# Altium project TCA785_HAFTWAVE.PrjPcb
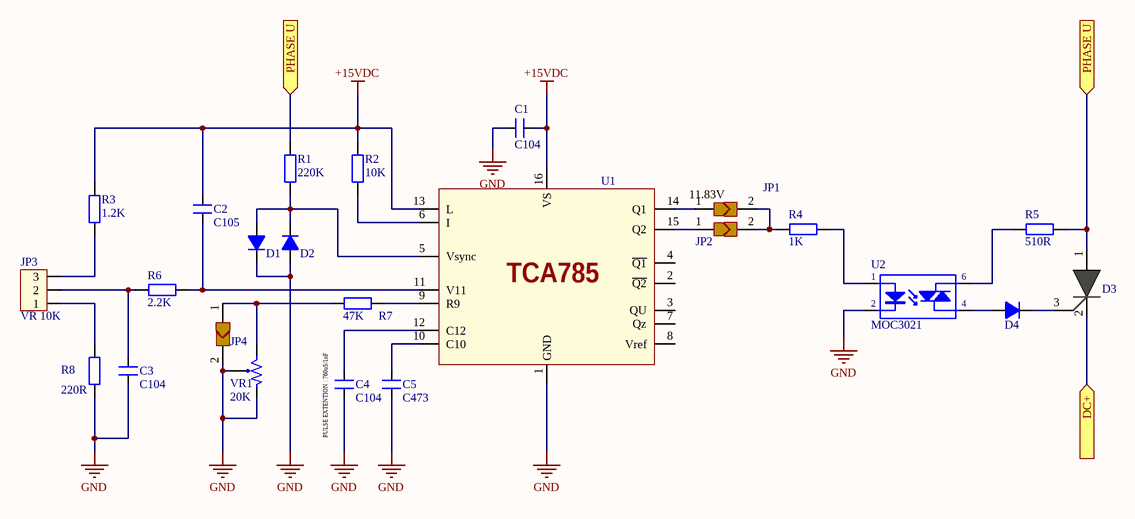
[diagram p0: TCA785-U.SchDoc]
4 sheets, 91 parts. Net scope: flat (ports and power ports of the same name join across sheets).
Board file: PCB1.PcbDoc
Sheets:
  TCA785-U.SchDoc
  TCA785-V.SchDoc
  TCA785-W.SchDoc
  POWER-SUPPLY.SchDoc

## Sheet TCA785-U.SchDoc
size A; SheetNumber: 1; SheetTotal: 4

### Parts
C1  C104  [CN2-O]
C2  C105  [CN2-O]
C3  C104  [CN2-O]
C4  C104  [CN2-O]
C5  C473  [CN2-O]
D1  Diode  1N4007  [DO41-1A]  (value not drawn)
D2  Diode  1N4007  [DO41-1A]  (value not drawn)
D3  SCR  [TO-220]  (value not drawn)
D4  Diode  1N4007  [DO41-1A]  (value not drawn)
JP1  PAD_Sellect  [PAD Select]  (value not drawn)
JP2  PAD_Sellect  [PAD Select]  (value not drawn)
JP3  VR 10K  [CON3]
JP4  PAD_Sellect  [PAD Select]  (value not drawn)
R1  220K  [R1/4W]
R2  10K  [R1/4W]
R3  1.2K  [R1/4W]
R4  1K  [R1/4W]
R5  510R  [R1/4W]
R6  2.2K  [R1/4W]
R7  47K  [R1/4W]
R8  220R  [R1/4W]
U1  TCA785Q  [DIP-16]  (value not drawn)
U2  MOC3021  [DIP6/W0.3 - MOC3021]
VR1  20K  [VR]

### Ports
DC+ (in), PHASE U (in)

### Nets
+15VDC: C1.2 C2.2 R2.1 R3.2 U1.13(L) U1.16(VS)
GND: C1.1 C3.1 C4.1 C5.1 D1.2 D2.1 JP4.2 R8.1 U1.1(GND) U2.2(K) VR1.1 VR1.2
NetC2_1: C2.1 R6.1 U1.11(V11)
NetC3_2: C3.2 JP3.2 R6.2
NetC4_2: C4.2 U1.12(C12)
NetC5_2: C5.2 U1.10(C10)
NetC18_2: D3.2(K) ; port DC+
NetD1_1: D1.1 D2.2 R1.2 U1.5(Vsync)
NetD3_1: D3.1(A) R1.1 R5.1 ; port PHASE U
NetD3_3: D3.3(G) D4.2
NetD4_1: D4.1 U2.4(E)
NetJP1_1: JP1.1 U1.14(Q1)
NetJP1_2: JP1.2 JP2.2 R4.2
NetJP2_1: JP2.1 U1.15(Q2)
NetJP3_1: JP3.1 R8.2
NetJP3_3: JP3.3 R3.1
NetJP4_1: JP4.1 R7.1 VR1.3
NetR2_2: R2.2 U1.6(I)
NetR4_1: R4.1 U2.1(A)
NetR5_2: R5.2 U2.6(C)
NetR7_2: R7.2 U1.9(R9)

Not connected (* = marked no-connect by the designer): U1 2(~{Q2}) 3(QU) 4(~{Q1}) 7(Qz) 8(Vref)

### Notes on the sheet
- (near JP1) 11.83V
- (near C4) PULSE EXTENTION : 760uS/1nF
- (in symbol TCA785Q) TCA785

### Library data of the parts
C1-C5 = CAP-gom: Value: 33pF
D1 D2 D4 = Diode  1N4007: Diode 1A; Value: 1N4007
D3 = BT151
JP3 = Con3: Connector 3; Value: Connector 3
R1-R8 = R1/4W: Resistor 1/4W; Value: R1/4W - 1K
U2 = MOC3021: Single Opto; Value: MOC3021
VR1 = VR: Var Resistor RM065; RM065-104: 10K; RM065-503: 5K; RM065-103: 1K

## Sheet TCA785-V.SchDoc
size A; SheetNumber: 2; SheetTotal: 4
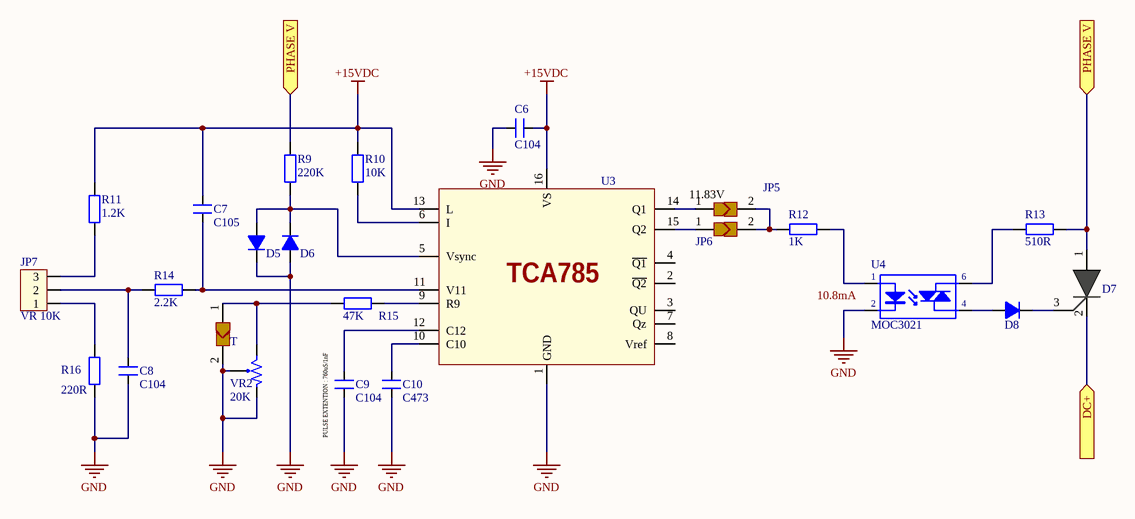
[diagram p1: TCA785-V.SchDoc]

### Parts
C6  C104  [CN2-O]
C7  C105  [CN2-O]
C8  C104  [CN2-O]
C9  C104  [CN2-O]
C10  C473  [CN2-O]
D5  Diode  1N4007  [DO41-1A]  (value not drawn)
D6  Diode  1N4007  [DO41-1A]  (value not drawn)
D7  SCR  [TO-220]  (value not drawn)
D8  Diode  1N4007  [DO41-1A]  (value not drawn)
JP5  PAD_Sellect  [PAD Select]  (value not drawn)
JP6  PAD_Sellect  [PAD Select]  (value not drawn)
JP7  VR 10K  [CON3]
R9  220K  [R1/4W]
R10  10K  [R1/4W]
R11  1.2K  [R1/4W]
R12  1K  [R1/4W]
R13  510R  [R1/4W]
R14  2.2K  [R1/4W]
R15  47K  [R1/4W]
R16  220R  [R1/4W]
T  PAD_Sellect  [PAD Select]  (value not drawn)
U3  TCA785Q  [DIP-16]  (value not drawn)
U4  MOC3021  [DIP6/W0.3 - MOC3021]
VR2  20K  [VR]

### Ports
DC+ (in), PHASE V (in)

### Nets
+15VDC: C6.2 C7.2 R10.1 R11.2 U3.13(L) U3.16(VS)
GND: C6.1 C8.1 C9.1 C10.1 D5.2 D6.1 R16.1 T.2 U3.1(GND) U4.2(K) VR2.1 VR2.2
NetC7_1: C7.1 R14.1 U3.11(V11)
NetC8_2: C8.2 JP7.2 R14.2
NetC9_2: C9.2 U3.12(C12)
NetC10_2: C10.2 U3.10(C10)
NetC18_2: D7.2(K) ; port DC+
NetD5_1: D5.1 D6.2 R9.2 U3.5(Vsync)
NetD7_1: D7.1(A) R9.1 R13.1 ; port PHASE V
NetD7_3: D7.3(G) D8.2
NetD8_1: D8.1 U4.4(E)
NetJP5_1: JP5.1 U3.14(Q1)
NetJP5_2: JP5.2 JP6.2 R12.2
NetJP6_1: JP6.1 U3.15(Q2)
NetJP7_1: JP7.1 R16.2
NetJP7_3: JP7.3 R11.1
NetR10_2: R10.2 U3.6(I)
NetR12_1: R12.1 U4.1(A)
NetR13_2: R13.2 U4.6(C)
NetR15_1: R15.1 T.1 VR2.3
NetR15_2: R15.2 U3.9(R9)

Not connected (* = marked no-connect by the designer): U3 2(~{Q2}) 3(QU) 4(~{Q1}) 7(Qz) 8(Vref)

### Notes on the sheet
- (near JP5) 11.83V
- (near C9) PULSE EXTENTION : 760uS/1nF
- Labels drawn without touching a wire or pin: 10.8mA
- (in symbol TCA785Q) TCA785

### Library data of the parts
C6-C10 = CAP-gom: Value: 33pF
D5 D6 D8 = Diode  1N4007: Diode 1A; Value: 1N4007
D7 = BT151
JP7 = Con3: Connector 3; Value: Connector 3
R9-R16 = R1/4W: Resistor 1/4W; Value: R1/4W - 1K
U4 = MOC3021: Single Opto; Value: MOC3021
VR2 = VR: as VR1 on sheet TCA785-U

## Sheet TCA785-W.SchDoc
size A; SheetNumber: 3; SheetTotal: 4
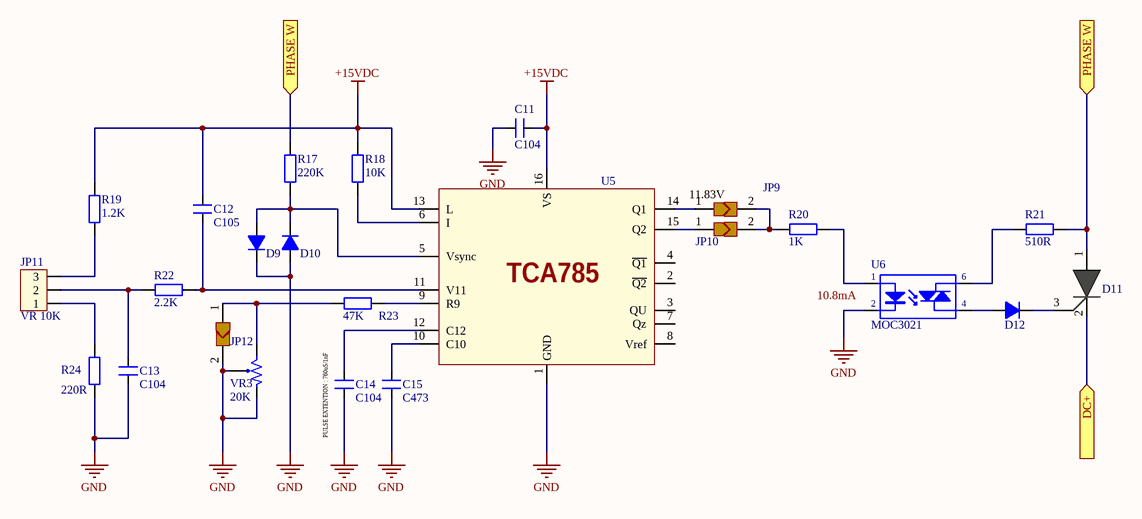
[diagram p2: TCA785-W.SchDoc]

### Parts
C11  C104  [CN2-O]
C12  C105  [CN2-O]
C13  C104  [CN2-O]
C14  C104  [CN2-O]
C15  C473  [CN2-O]
D9  Diode  1N4007  [DO41-1A]  (value not drawn)
D10  Diode  1N4007  [DO41-1A]  (value not drawn)
D11  SCR  [TO-220]  (value not drawn)
D12  Diode  1N4007  [DO41-1A]  (value not drawn)
JP9  PAD_Sellect  [PAD Select]  (value not drawn)
JP10  PAD_Sellect  [PAD Select]  (value not drawn)
JP11  VR 10K  [CON3]
JP12  PAD_Sellect  [PAD Select]  (value not drawn)
R17  220K  [R1/4W]
R18  10K  [R1/4W]
R19  1.2K  [R1/4W]
R20  1K  [R1/4W]
R21  510R  [R1/4W]
R22  2.2K  [R1/4W]
R23  47K  [R1/4W]
R24  220R  [R1/4W]
U5  TCA785Q  [DIP-16]  (value not drawn)
U6  MOC3021  [DIP6/W0.3 - MOC3021]
VR3  20K  [VR]

### Ports
DC+ (in), PHASE W (in)

### Nets
+15VDC: C11.2 C12.2 R18.1 R19.2 U5.13(L) U5.16(VS)
GND: C11.1 C13.1 C14.1 C15.1 D9.2 D10.1 JP12.2 R24.1 U5.1(GND) U6.2(K) VR3.1 VR3.2
NetC12_1: C12.1 R22.1 U5.11(V11)
NetC13_2: C13.2 JP11.2 R22.2
NetC14_2: C14.2 U5.12(C12)
NetC15_2: C15.2 U5.10(C10)
NetC18_2: D11.2(K) ; port DC+
NetD9_1: D9.1 D10.2 R17.2 U5.5(Vsync)
NetD11_1: D11.1(A) R17.1 R21.1 ; port PHASE W
NetD11_3: D11.3(G) D12.2
NetD12_1: D12.1 U6.4(E)
NetJP9_1: JP9.1 U5.14(Q1)
NetJP9_2: JP9.2 JP10.2 R20.2
NetJP10_1: JP10.1 U5.15(Q2)
NetJP11_1: JP11.1 R24.2
NetJP11_3: JP11.3 R19.1
NetJP12_1: JP12.1 R23.1 VR3.3
NetR18_2: R18.2 U5.6(I)
NetR20_1: R20.1 U6.1(A)
NetR21_2: R21.2 U6.6(C)
NetR23_2: R23.2 U5.9(R9)

Not connected (* = marked no-connect by the designer): U5 2(~{Q2}) 3(QU) 4(~{Q1}) 7(Qz) 8(Vref)

### Notes on the sheet
- (near JP9) 11.83V
- (near C14) PULSE EXTENTION : 760uS/1nF
- Labels drawn without touching a wire or pin: 10.8mA
- (in symbol TCA785Q) TCA785

### Library data of the parts
C11-C15 = CAP-gom: Value: 33pF
D9 D10 D12 = Diode  1N4007: Diode 1A; Value: 1N4007
D11 = BT151
JP11 = Con3: Connector 3; Value: Connector 3
R17-R24 = R1/4W: Resistor 1/4W; Value: R1/4W - 1K
U6 = MOC3021: Single Opto; Value: MOC3021
VR3 = VR: as VR1 on sheet TCA785-U

## Sheet POWER-SUPPLY.SchDoc
size A; SheetNumber: 4; SheetTotal: 4
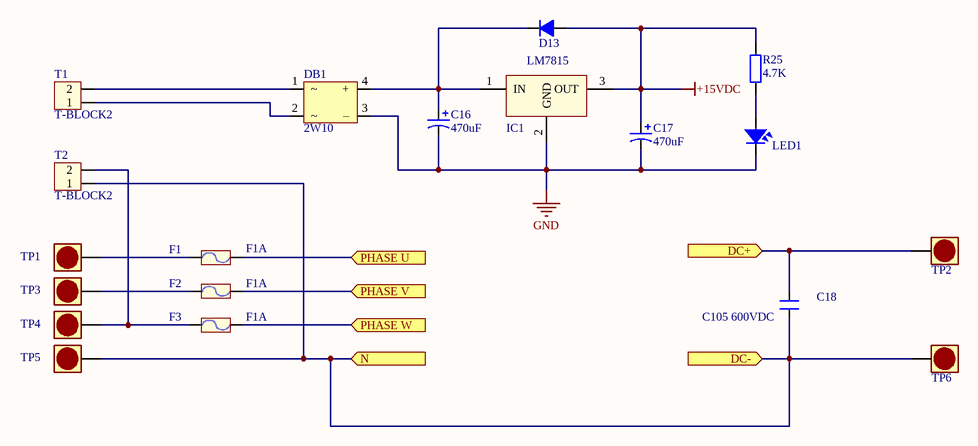
[diagram p3: POWER-SUPPLY.SchDoc]

### Parts
C16  470uF  [C6mm]
C17  470uF  [C6mm]
C18  C105 600VDC  [CAP-POLY-25mm]
D13  Diode  1N4007  [DO41-1A]  (value not drawn)
DB1  2W10  [DB-2W10]
F1  F1A  [Fuse]
F2  F1A  [Fuse]
F3  F1A  [Fuse]
IC1  LM7815  [QTO-220]
LED1  LED  [LED-5-BLUE]  (value not drawn)
R25  4.7K  [R1/4W]
T1  T-BLOCK2  [T-2EDGV-5.08- 2P]
T2  T-BLOCK2  [T-2EDGV-5.08- 2P]
TP1  JP1P  [PW-JP]  (value not drawn)
TP2  JP1P  [PW-JP]  (value not drawn)
TP3  JP1P  [PW-JP]  (value not drawn)
TP4  JP1P  [PW-JP]  (value not drawn)
TP5  JP1P  [PW-JP]  (value not drawn)
TP6  JP1P  [PW-JP]  (value not drawn)

### Ports
DC+ (in), DC- (in), N (in), PHASE U (in), PHASE V (in), PHASE W (in)

### Nets
+15VDC: C17.1 D13.1 IC1.3(OUT) R25.2
GND: C16.2 C17.2 DB1.3(–) IC1.2(GND) LED1.2
NetC16_1: C16.1 D13.2 DB1.4(+) IC1.1(IN)
NetC18_1: C18.1 T2.1 TP5.1 TP6.1 ; port N, port DC-
NetC18_2: C18.2 TP2.1 ; port DC+
NetD3_1: F1.2 ; port PHASE U
NetD7_1: F2.2 ; port PHASE V
NetD11_1: F3.2 ; port PHASE W
NetDB1_1: DB1.1 T1.2
NetDB1_2: DB1.2 T1.1
NetF1_1: F1.1 TP1.1
NetF2_1: F2.1 TP3.1
NetF3_1: F3.1 T2.2 TP4.1
NetLED1_1: LED1.1 R25.1

### Library data of the parts
C16 C17 = CAP-Radial: Published: 8-Jun-2000; LatestRevisionDate: 17-Jul-2002; LatestRevisionNote: Re-released for DXP Platform.; PackageReference: POLAR0.8; Publisher: Altium Limited; value: ?
C18 = CAP-POLY
D13 = Diode  1N4007: Diode 1A; Value: 1N4007
DB1 = DIODE BRIDGE1
F1-F3 = Fuse: Designed by: VanDungEvn; Value: Fuse
IC1 = LM78xx: On ap +, from + 5 to + 24VDC; Value: LM7805
LED1 = LED: LED Single colour Green and Red; Value: LED 3 ly Single Colour
R25 = R1/4W: Resistor 1/4W; Value: R1/4W - 1K
T1 T2 = T-BLOCK2: T-BLOCK2(Green); Value: Header 2

## Nets that join several sheets
+15VDC: TCA785-U (6 pins), TCA785-V (6 pins), TCA785-W (6 pins), POWER-SUPPLY (C17.1 D13.1 IC1.3 R25.2)
GND: TCA785-U (12 pins), TCA785-V (12 pins), TCA785-W (12 pins), POWER-SUPPLY (5 pins)
NetC18_2: TCA785-U (D3.2), TCA785-V (D7.2), TCA785-W (D11.2), POWER-SUPPLY (C18.2 TP2.1)
NetD3_1: TCA785-U (D3.1 R1.1 R5.1), POWER-SUPPLY (F1.2)
NetD7_1: TCA785-V (D7.1 R9.1 R13.1), POWER-SUPPLY (F2.2)
NetD11_1: TCA785-W (D11.1 R17.1 R21.1), POWER-SUPPLY (F3.2)